# EAGLE schematic dog tracker rev1 (EAGLE 9.6.0)
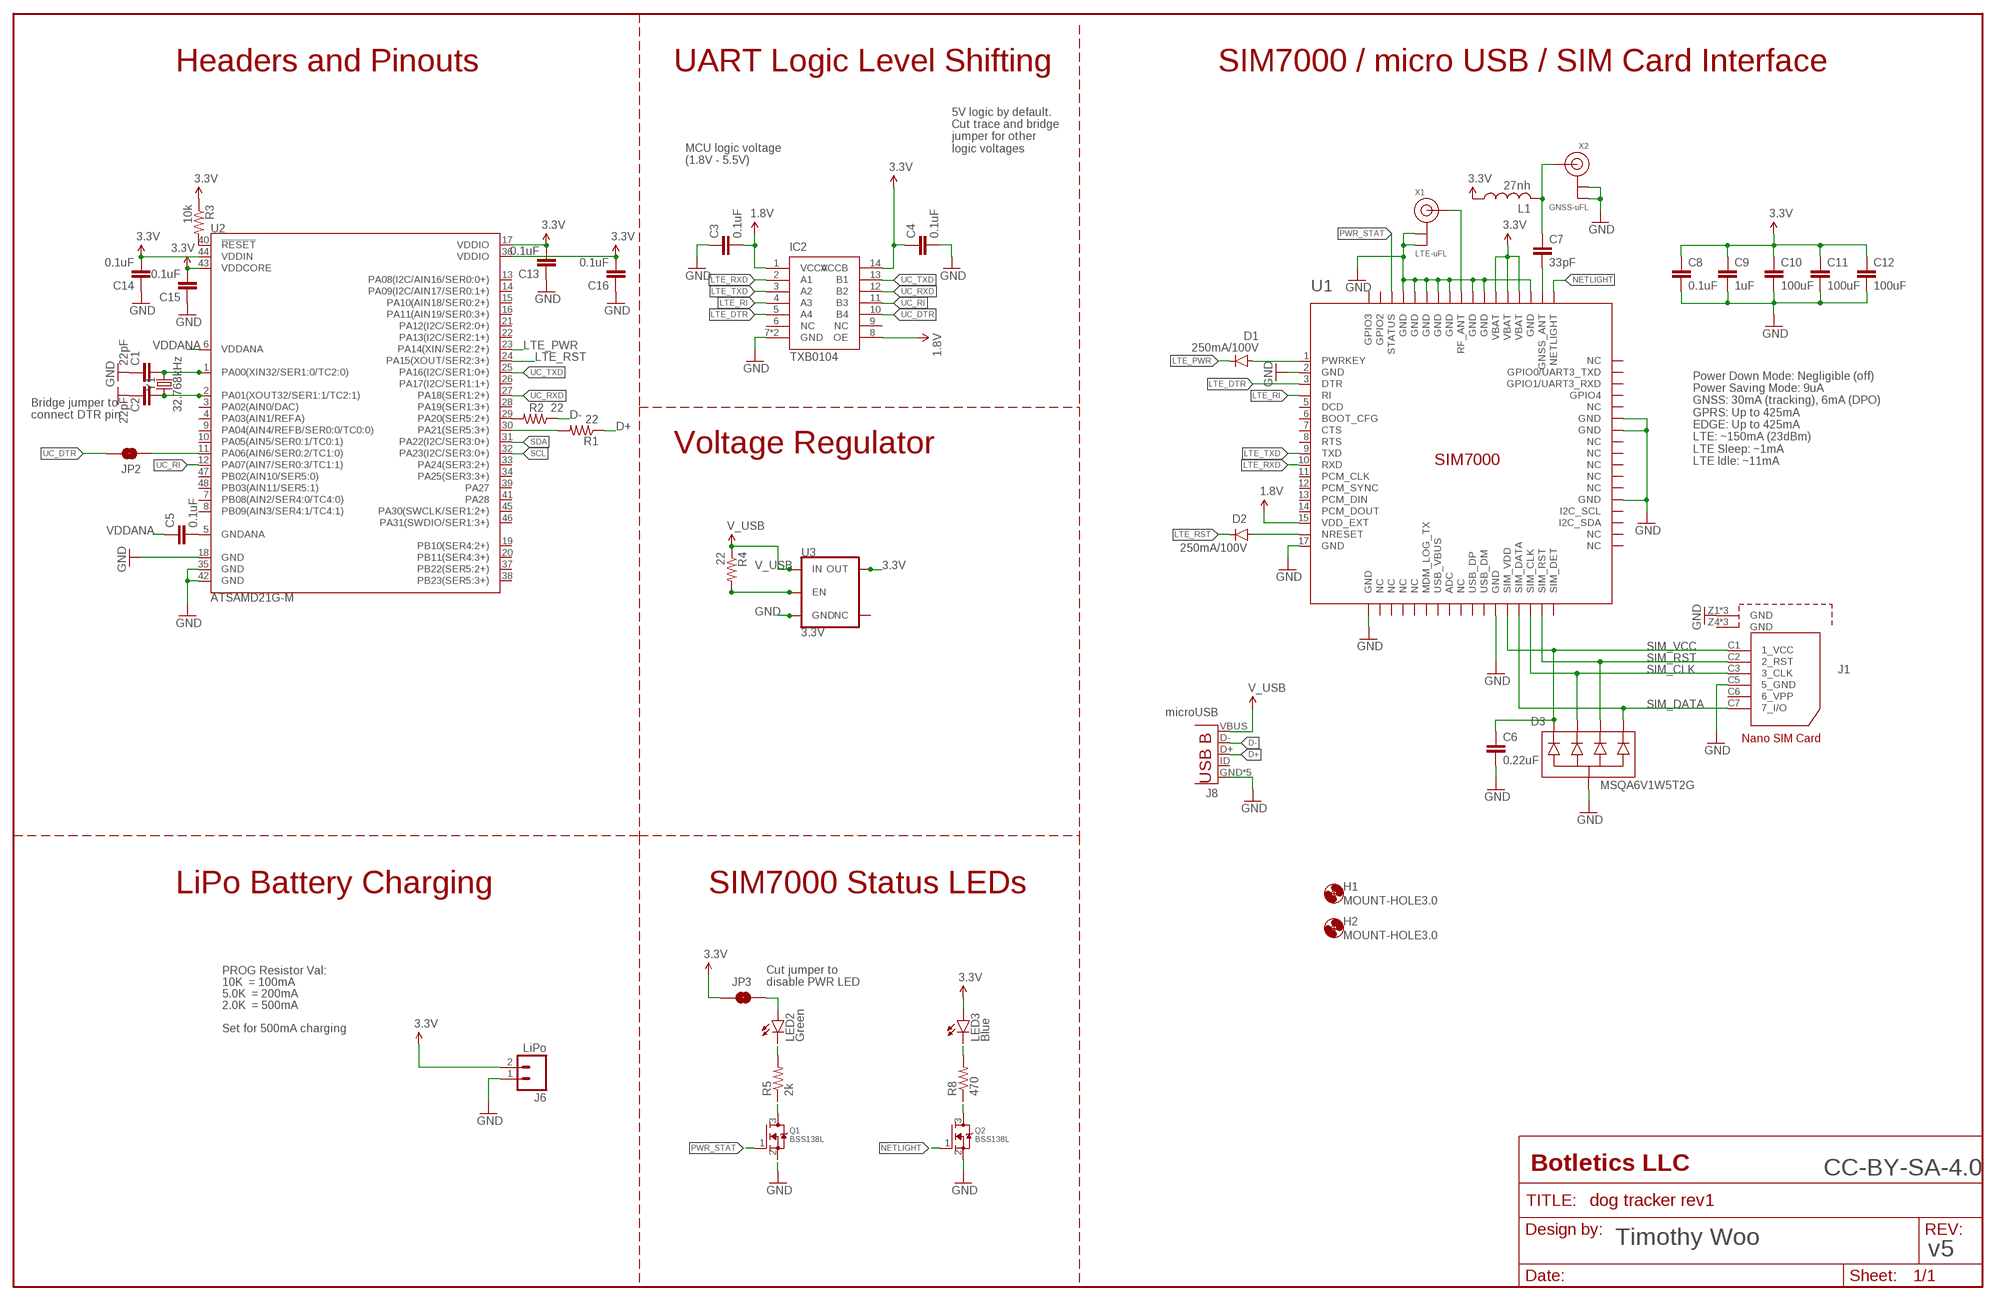
[diagram p0: schematic, sheet 1]

## Parts
C1  22pF  CAPMARKED-0603  [0603-CAP-MARKED]
C2  22pF  CAPMARKED-0603  [0603-CAP-MARKED]
C3  0.1uF  CAPMARKED-0603  [0603-CAP-MARKED]
C4  0.1uF  CAPMARKED-0603  [0603-CAP-MARKED]
C5  0.1uF  CAPMARKED-0603  [0603-CAP-MARKED]
C6  0.22uF  CAPMARKED-0603  [0603-CAP-MARKED]
C7  33pF  CAPMARKED-0603  [0603-CAP-MARKED]
C8  0.1uF  CAPMARKED-0603  [0603-CAP-MARKED]
C9  1uF  CAPMARKED-0603  [0603-CAP-MARKED]
C10  100uF  CAPMARKED-1210  [1210]
C11  100uF  CAPMARKED-1210  [1210]
C12  100uF  CAPMARKED-1210  [1210]
C13  0.1uF  CAPMARKED-0603  [0603-CAP-MARKED]
C14  0.1uF  CAPMARKED-0603  [0603-CAP-MARKED]
C15  0.1uF  CAPMARKED-0603  [0603-CAP-MARKED]
C16  0.1uF  CAPMARKED-0603  [0603-CAP-MARKED]
D1  250mA/100V  DIODESOD323  [SOD-323]
D2  250mA/100V  DIODESOD323  [SOD-323]
D3  MSQA6V1W5T2G  TVS-DIODE-ARRAY-4X  [SOT-353]
H1  MOUNT-HOLE3.0  [3,0]
H2  MOUNT-HOLE3.0  [3,0]
IC2  TXB0104  LEVEL_SHIFTER_TXB0104TXB0104RGYR  [VQFN-14]
J1  693043020611  [693043020611]
J6  LiPo  M02-JST-2MM-SMT  [JST-2-SMD]
J8  microUSB  MICRO-USB_SMD_NOSHIELDV1  [USB-B-MICRO-SMD]
JP2  JUMPER-SMT_2_NO_SILK  [SMT-JUMPER_2_NO_SILK]
JP3  JUMPER-SMT_2_NC_TRACE_SILK  [SMT-JUMPER_2_NC_TRACE_SILK]
L1  27nh  L-USL2012C  [L2012C]
LED2  Green  LED0603-MARKED  [LED-0603-MARKED]
LED3  Blue  LED0603-MARKED  [LED-0603-MARKED]
Q1  BSS138L  MOSFET-NGENERIC  [SOT23-3]
Q2  BSS138L  MOSFET-NGENERIC  [SOT23-3]
R1  22  RESISTORMARKED-0603  [0603-RES-MARKED]
R2  22  RESISTORMARKED-0603  [0603-RES-MARKED]
R3  10k  RESISTORMARKED-0603  [0603-RES-MARKED]
R4  22  RESISTORMARKED-0603  [0603-RES-MARKED]
R5  2k  RESISTORMARKED-0603  [0603-RES-MARKED]
R8  470  RESISTORMARKED-0603  [0603-RES-MARKED]
U1  SIM7000  [SIM7000]
U2  ATSAMD21G-M  [QFN-48]
U3  3.3V  V_REG_AP2112K-3.3V  [SOT23-5]
X1  LTE-uFL  ANTENNA_U.FL  [U.FL]
X2  GNSS-uFL  ANTENNA_U.FL  [U.FL]
Y1  32.768kHz  CRYSTAL-32.768KHZSMD-3.2X1.5  [CRYSTAL-SMD-3.2X1.5MM]

## Nets
1.8V: C3.2 IC2.1(VCCA) IC2.8(OE) U1.15(VDD_EXT)
3.3V: C4.1 C8.1 C9.1 C10.1 C11.1 C12.1 C13.2 C14.2 C15.2 C16.2 IC2.14(VCCB) J6.2 JP3.1 L1.1 LED3.A R3.1 U1.55(VBAT) U1.56(VBAT) U1.57(VBAT) U2.17(VDDIO) U2.36(VDDIO) U2.43(VDDCORE) U2.44(VDDIN) U3.5(OUT)
D+: J8.D+ R1.1
D-: J8.D- R2.1
GND: C1.1 C2.1 C3.1 C4.2 C6.2 C8.2 C9.2 C10.2 C11.2 C12.2 C13.1 C14.1 C15.1 C16.1 D3.2(COM) IC2.7(GND) IC2.PAD(GND) J1.C5(5_GND) J1.Z1(GND) J1.Z2(GND) J1.Z3(GND) J6.1 J8.GND J8.SHIELD1(GND) J8.SHIELD2(GND) J8.SHIELD3(GND) J8.SHIELD4(GND) Q1.2(S) Q2.2(S) U1.2(GND) U1.17(GND) U1.18(GND) U1.29(GND) U1.39(GND) U1.45(GND) U1.46(GND) U1.54(GND) U1.58(GND) U1.59(GND) U1.61(GND) U1.62(GND) U1.63(GND) U1.64(GND) U1.65(GND) U2.18(GND) U2.35(GND) U2.42(GND) U3.2(GND) X1.1(GND) X1.2(GND) X2.1(GND) X2.2(GND)
LTE_DTR: IC2.5(A4) U1.3(DTR)
LTE_PWR: D1.C U2.23(PA14(XIN/SER2:2+))
LTE_RI: IC2.4(A3) U1.4(RI)
LTE_RST: D2.C U2.24(PA15(XOUT/SER2:3+))
LTE_RXD: IC2.2(A1) U1.10(RXD)
LTE_TXD: IC2.3(A2) U1.9(TXD)
N$1: C7.2 U1.53(GNSS_ANT)
N$2: D1.A U1.1(PWRKEY)
N$3: C7.1 L1.2 X2.3(SIGNAL)
N$4: Q1.3(D) R5.1
N$5: LED2.C R5.2
N$6: C2.2 U2.2(PA01(XOUT32/SER1:1/TC2:1)) Y1.P$1
N$7: C1.2 U2.1(PA00(XIN32/SER1:0/TC2:0)) Y1.P$2
N$8: JP2.1 U2.11(PA06(AIN6/SER0:2/TC1:0))
N$9: R1.2 U2.30(PA21(SER5:3+))
N$10: Q2.3(D) R8.1
N$11: LED3.C R8.2
N$12: JP3.2 LED2.A
N$13: R2.2 U2.29(PA20(SER5:2+))
N$14: C5.2 U2.5(GNDANA)
N$15: R3.2 U2.40(!RESET!)
N$17: R4.2 U3.3(EN)
NETLIGHT: Q2.1(G) U1.52(NETLIGHT)
NRESET: D2.A U1.16(NRESET)
PWR_STAT: Q1.1(G) U1.66(STATUS)
RF_ANT: U1.60(RF_ANT) X1.3(SIGNAL)
SCL: U2.32(PA23(I2C/SER3:0+))
SDA: U2.31(PA22(I2C/SER3:0+))
SIM_CLK: D3.3 J1.C3(3_CLK) U1.32(SIM_CLK)
SIM_DATA: D3.5 J1.C7(7_I/O) U1.31(SIM_DATA)
SIM_RST: D3.4 J1.C2(2_RST) U1.33(SIM_RST)
SIM_VCC: C6.1 D3.1 J1.C1(1_VCC) U1.30(SIM_VDD)
UC_DTR: IC2.10(B4) JP2.2
UC_RI: IC2.11(B3) U2.12(PA07(AIN7/SER0:3/TC1:1))
UC_RXD: IC2.12(B2) U2.27(PA18(SER1:2+))
UC_TXD: IC2.13(B1) U2.25(PA16(I2C/SER1:0+))
V_USB: J8.VBUS R4.1 U3.1(IN)
VDDANA: C5.1 U2.6(VDDANA)
Unconnected: IC2.6(NC) IC2.9(NC) J1.C6(6_VPP) J1.Z4(GND) J1.Z5(GND) J1.Z6(GND) J8.ID(USBID) U1.5(DCD) U1.6(BOOT_CFG) U1.7(CTS) U1.8(RTS) U1.11(PCM_CLK) U1.12(PCM_SYNC) U1.13(PCM_DIN) U1.14(PCM_DOUT) U1.19(NC) U1.20(NC) U1.21(NC) U1.22(NC) U1.23(MDM_LOG_TX) U1.24(USB_VBUS) U1.25(ADC) U1.26(NC) U1.27(USB_DP) U1.28(USB_DM) U1.34(SIM_DET) U1.35(NC) U1.36(NC) U1.37(I2C_SDA) U1.38(I2C_SCL) U1.40(NC) U1.41(NC) U1.42(NC) U1.43(NC) U1.44(NC) U1.47(NC) U1.48(GPIO4) U1.49(GPIO1/UART3_RXD) U1.50(GPIO0/UART3_TXD) U1.51(NC) U1.67(GPIO2) U1.68(GPIO3) U2.3(PA02(AIN0/DAC)) U2.4(PA03(AIN1/REFA)) U2.7(PB08(AIN2/SER4:0/TC4:0)) U2.8(PB09(AIN3/SER4:1/TC4:1)) U2.9(PA04(AIN4/REFB/SER0:0/TC0:0)) U2.10(PA05(AIN5/SER0:1/TC0:1)) U2.13(PA08(I2C/AIN16/SER0:0+)) U2.14(PA09(I2C/AIN17/SER0:1+)) U2.15(PA10(AIN18/SER0:2+)) U2.16(PA11(AIN19/SER0:3+)) U2.19(PB10(SER4:2+)) U2.20(PB11(SER4:3+)) U2.21(PA12(I2C/SER2:0+)) U2.22(PA13(I2C/SER2:1+)) U2.26(PA17(I2C/SER1:1+)) U2.28(PA19(SER1:3+)) U2.33(PA24(SER3:2+)) U2.34(PA25(SER3:3+)) U2.37(PB22(SER5:2+)) U2.38(PB23(SER5:3+)) U2.39(PA27) U2.41(PA28) U2.45(PA30(SWCLK/SER1:2+)) U2.46(PA31(SWDIO/SER1:3+)) U2.47(PB02(AIN10/SER5:0)) U2.48(PB03(AIN11/SER5:1)) U3.4(NC)

## Notes on the sheet
- Headers and Pinouts | UART Logic Level Shifting | SIM7000 / micro USB / SIM Card Interface
- 5V logic by default.
  Cut trace and bridge
  jumper for other
  logic voltages
- MCU logic voltage
  (1.8V - 5.5V)
- Bridge jumper to
  connect DTR pin
- Voltage Regulator
- Power Down Mode: Negligible (off)
  Power Saving Mode: 9uA
  GNSS: 30mA (tracking), 6mA (DPO)
  GPRS: Up to 425mA
  EDGE: Up to 425mA
  LTE: ~150mA (23dBm)
  LTE Sleep: ~1mA
  LTE Idle: ~11mA
- LiPo Battery Charging | SIM7000 Status LEDs
- PROG Resistor Val:
- 10K  = 100mA
- Cut jumper to
  disable PWR LED
- 5.0K  = 200mA
- 2.0K  = 500mA
- Set for 500mA charging
- CC-BY-SA-4.0
- Timothy Woo
- v5

## Library data of the parts
C1-C16 = TimWoo-Capacitors:CAP: Capacitor Standard 0603 ceramic capacitor, and 0.1" leaded capacitor.
D1 D2 = TimWoo-Diodes:DIODE: Diode These are standard reverse protection diodes and small signal diodes. SMA package can handle up to about 1A. SOD-323 can handle about 200mA. What the SOD-323 package when ordering, there are some mfgs out there that are 5-pin packages.; PROD_ID: DIO-09646
D3 = TimWoo-Diodes:TVS-DIODE-ARRAY-4X
H1 H2 = holes:MOUNT-HOLE: MOUNTING HOLE with drill center marker
IC2 = TimWoo-IC:LEVEL_SHIFTER_TXB0104
J1 = Wurth_Elektronik_Electromechanic_Input-Output_Connectors_rev16b:693043020611: WR-CRD_Nano SIM_Push & Pull_SMT Nano SIM Push & Pull Type SMT - 1.20mm Height - T&R with Mylar for Pick & Place Code:Con_I-O_COM_CRD_SIM_Nano_693043020611_693043020611 <http://katalog.we-online.de/media/images/eican/Con_I-O_COM_CRD_SIM_Nano_693043020611_pf2.jpg> Details see: http://katalog.we-online.de/en/em/693_043_020_611/693_043_020_611?m Created 2014-12-22, aslant tao 2014 (C) Würth Elektronik
J6 = TimWoo-Connectors:M02: Standard 2-pin 0.1" header. Use with - straight break away headers ( PRT-00116) - right angle break away headers (PRT-00553) - swiss pins (PRT-00743) - machine pins (PRT-00117) - female headers (PRT-00115) Molex polarized connector foot print use with: PRT-08233 with associated crimp pins and housings. 2.54_SCREWTERM for use with PRT-10571. 3.5mm Screw Terminal footprints for PRT-08084 5mm Screw Terminal footprints for use with PRT-08432; PROD_ID: CONN-11443
J8 = TimWoo-Connectors:MICRO-USB_SMD_NOSHIELD
JP2 = TimWoo-Connectors:JUMPER-SMT_2_NO: Normally open jumper This jumper has two pads in close proximity to each other. Apply solder to close the connection. Round pads are easier to solder for beginners, but are a lot larger. SparkFun Product that uses the round pads: SparkFun EL Sequencer <https://www.sparkfun.com/products/12781>
JP3 = TimWoo-Connectors:JUMPER-SMT_2_NC_TRACE: Normally closed trace jumper This jumper has a trace between two pads so it's normally closed (NC). Use a razor knife to open the connection. For best results follow the IPC guidelines for cutting traces: Cutout at least 0.063 mm (0.005 in). Remove all loose material to clean up the cut area. Seal the cut with an approved epoxy. Reapply solder to reclose the connection.
L1 = rcl:L-US: INDUCTOR, American symbol; SPICEPREFIX: L
LED2 LED3 = TimWoo-LED:LED: LEDs Standard schematic elements and footprints for 5mm, 3mm, 1206, and 0603 sized LEDs. 5mm - Spark Fun Electronics SKU : COM-00529 (and others)
Q1 Q2 = TimWoo-MOSFETs:MOSFET-N: N-Channel Mosfet DMG2302UK - 20V 2.8A SOT23 [Digikey: DMG2302UK-7DICT-ND] 2N7002E - 60V 260mA SOT23 [Digikey: 2N7002ET1GOSTR-ND] - REEL BSH103 - 30V 850mA SOT23 [Digikey: 568-5013-1-ND]
R1-R5 R8 = TimWoo-Resistors:RESISTOR: Resistor Basic schematic elements and footprints for 0603, 1206, and PTH resistors.
U1 = TimWoo-RF:SIM7000
U2 = SparkFun-IC-Microcontroller:ATSAMD21G: Atmel SAMD21G SMART ARM-Based Microcontroller The Atmel ® | SMART ™ SAM D21 is a series of low-power microcontrollers using the 32-bit ARM ® Cortex ® -M0+ processor, and ranging from 32- to 64-pins with up to 256KB Flash and 32KB of SRAM. The SAM D21 devices operate at a maximum frequency of 48MHz and reach 2.46 CoreMark/MHz. They are designed for simple and intuitive migration with identical peripheral modules, hex compatible code, identical linear address map and pin compatible migration paths between all devices in the product series. All devices include intelligent and flexible peripherals, Atmel Event System for inter-peripheral signaling, and support for capacitive touch button, slider and wheel user interfaces. Datasheet <https://cdn.sparkfun.com/datasheets/Dev/Arduino/Boards/Atmel-42181-SAM-D21_Datasheet.pdf> SparkFun Products SparkFun SAMD21 Mini Breakout <https://www.sparkfun.com/products/13664> (DEV-13664) SparkFun SAMD21 Dev Breakout <https://www.sparkfun.com/products/13672> (DEV-13672); PROD_ID: IC-13064
U3 = SparkFun-IC-Power:V_REG_AP2112: AP2112 - 600mA CMOS LDO Regulator w/ Enable The AP2112 is CMOS process low dropout linear regulator with enable function, the regulator delivers a guaranteed 600mA (min.) continuous load current. Features Output Voltage Accuracy: ±1.5% Output Current: 600mA (Min.) Foldback Short Current Protection: 50mA Enable Function to Turn ON/OFF VOUT Low Dropout Voltage (3.3V): 250mV (Typ.) @IOUT=600mA Excellent Load Regulation: 0.2%/A (Typ.) Excellent Line Regulation: 0.02%/V (Typ.) Low Quiescent Current: 55μA (Typ.) Low Standby Current: 0.01μA (Typ.) Low Output Noise: 50μVRMS PSRR: 100Hz -65dB, 1kHz -65dB OTSD Protection Stable with 1.0μF Flexible Cap: Ceramic, Tantalum and Aluminum Electrolytic Operation Temperature Range: -40°C to 85°C ESD: MM 400V, HBM 4000V; PROD_ID: VREG-12457
X1 X2 = TimWoo-Connectors:ANTENNA_U.FL: U.FL Antenna Connector
Y1 = SparkFun-Clocks:CRYSTAL-32.768KHZ: 32.768kHz Crystal Frequency: 32.768kHz Frequency Stability: ±20ppm Load Capacitance: 12.5pF (PTH-2X6 & SMD-3.2X1.5), 6pF (SMD-2X6) SparkFun Products: SparkFun BigTime Watch Kit <https://www.sparkfun.com/products/11734> SparkFun nRF52832 Breakout <https://www.sparkfun.com/products/13990> SparkFun Real Time Clock Module <https://www.sparkfun.com/products/12708>; PROD_ID: XTAL-13062

## Net classes
1 power: width 0.406 mm